# EAGLE design fabflash-mk-2.3-battcon (EAGLE 6.5.0)
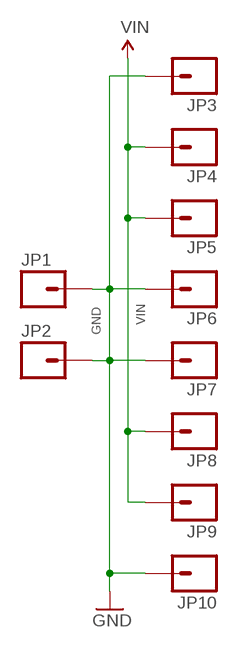
[diagram p0: schematic, sheet 1]

## Parts
JP1  M01NOT-A-VIA-NOPE  [1X01_NOSILK_NOSTOP]
JP2  M01NOT-A-VIA-NOPE  [1X01_NOSILK_NOSTOP]
JP3  M01SMD-1X2.5MM-NS  [1X01-SMD-1X2.5MM-NS]
JP4  M01NOSILK-KIT  [1X01NS-KIT]
JP5  M01NOSILK-KIT  [1X01NS-KIT]
JP6  M01SMD-1X2.5MM-NS  [1X01-SMD-1X2.5MM-NS]
JP7  M01SMD-1X2.5MM-NS  [1X01-SMD-1X2.5MM-NS]
JP8  M01NOSILK-KIT  [1X01NS-KIT]
JP9  M01NOSILK-KIT  [1X01NS-KIT]
JP10  M01SMD-1X2.5MM-NS  [1X01-SMD-1X2.5MM-NS]

## Nets
GND: JP1.P$1 JP2.P$1 JP3.1 JP6.1 JP7.1 JP10.1
VIN: JP4.1 JP5.1 JP8.1 JP9.1

## Library data of the parts
JP1-JP10 = A_butts:M01: Header 1 Standard 1-pin 0.1" header. Use with straight break away headers (SKU : PRT-00116), right angle break away headers (PRT-00553), swiss pins (PRT-00743), machine pins (PRT-00117), and female headers (PRT-00115).

## Board
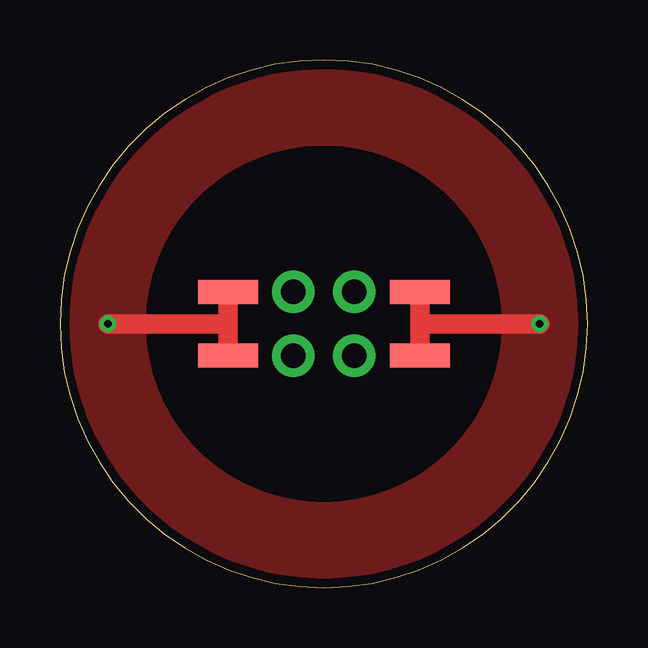
[diagram p1: board, top side]
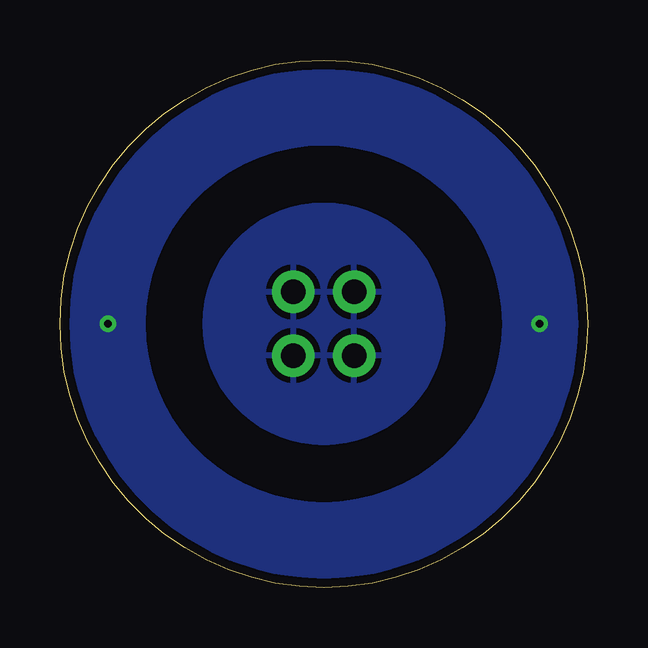
[diagram p2: board, bottom side, seen from below]

Size 22 x 22 mm. Coordinates in mm from the lower left corner, seen from the top.
Outline: 0,11 arc90 11,0 arc90 22,11 arc90 11,22 arc90 0,11
Copper layers (1*16): Top 0.0356mm / dielectric 1.5011mm / Bottom 0.0356mm
Design rules "LaenPCBOrder2": minimum track width 6mil, minimum drill 13mil, track to track 6mil, track to pad 6mil, pad to pad 6mil, via to via 6mil, smd to smd 6mil, copper to edge 15mil, drill to drill 6mil, minimum pad ring 7mil, minimum via ring 7mil, stop-mask expansion 3mil, vias tented up to drill 20mil, thermal gap 10mil

### Footprints (pad centres in the part's own frame; a part is rotated, then mirrored left to right if it is on the bottom)
1X01_NOSILK_NOSTOP = drill 0.33: P$1 0,0
1X01-SMD-1X2.5MM-NS = smd 1 x 2.5: 1 0,0
1X01NS-KIT = drill 1.016 pad 1.778: 1 0,0

### Placement (x,y rotation side)
JP1  2,11 0 top
JP2  20,11 0 top
JP3  7,12.33 270 top
JP4  12.27,12.33 90 top
JP5  9.73,12.33 90 top
JP6  15,12.33 90 top
JP7  7,9.67 270 top
JP8  9.73,9.67 270 top
JP9  12.27,9.67 270 top
JP10  15,9.67 90 top

### Tracks (layer width: path | path; a pad name or v marks a point on that pad's centre or on a via)
GND
  Top 0.813: JP7.1 7,11 | 7,11 JP3.1 | JP10.1 15,11 | 15,11 JP6.1 | JP2.P$1 15,11 | JP1.P$1 7,11
  pour Top (rank 6): 0,11 0,22 11,22 11,18.5 arc90 3.5,11
  pour Top (rank 6): 0,0 0,11 3.5,11 arc90 11,3.5 11,0
  pour Top (rank 6): 11,3.5 11,0 22,0 22,11 18.5,11 arc-90
  pour Top (rank 6): 11,22 22,22 22,11 18.5,11 arc90 11,18.5
  pour Bottom (rank 6): 0,11 0,22 11,22 11,18.5 arc90 3.5,11
  pour Bottom (rank 6): 11,22 22,22 22,11 18.5,11 arc90 11,18.5
  pour Bottom (rank 6): 11,3.5 11,0 22,0 22,11 18.5,11 arc-90
  pour Bottom (rank 6): 0,0 0,11 3.5,11 arc90 11,3.5 11,0
VIN
  pour Bottom: 11,6 arc-90 6,11 arc-90 11,16 arc-90 16,11 arc-90